# EAGLE design 3dring (EAGLE 7.1.0)
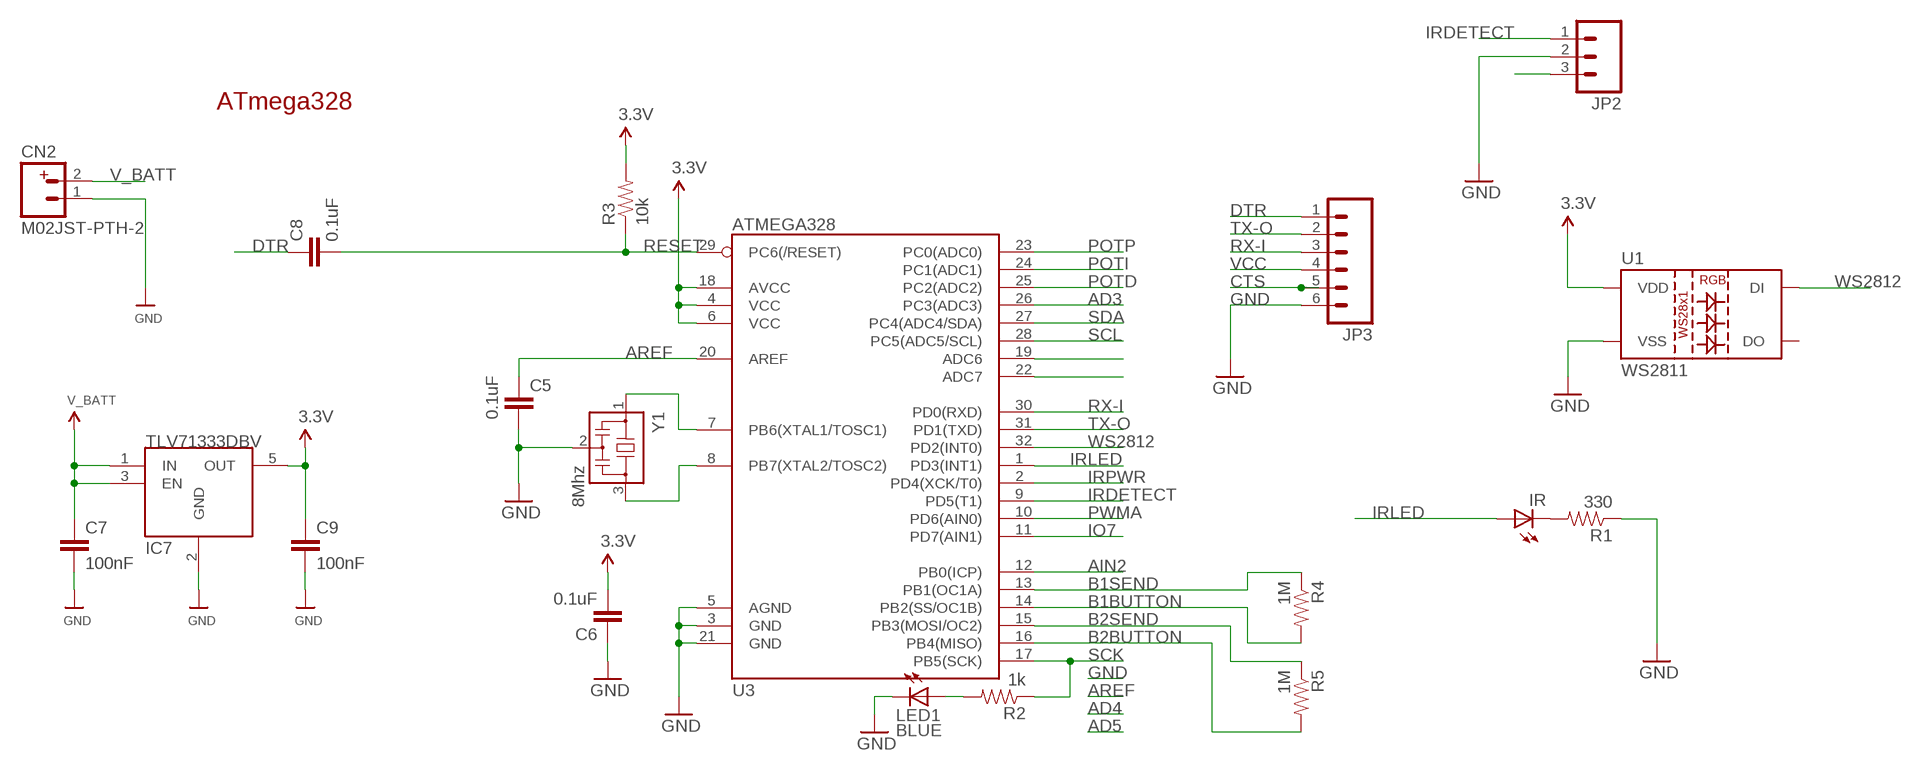
[diagram p0: schematic, sheet 1]

## Parts
C5  0.1uF  CAP0402-CAP  [0402-CAP]
C6  0.1uF  CAP0402-CAP  [0402-CAP]
C7  100nF  C-EUC0402  [C0402]
C8  0.1uF  CAP0402-CAP  [0402-CAP]
C9  100nF  C-EUC0402  [C0402]
CN2  M02JST-PTH-2  [JST-2-PTH]
IC7  TLV71333DBV  [SOT-23-5]
IR  LED5MM  [LED5MM]
JP2  M03PTH  [1X03]
JP3  M06SMD-1MM  [1X06-1MM]
LED1  BLUE  LED0603  [LED-0603]
R1  330  RESISTOR0402-RES  [0402-RES]
R2  1k  RESISTOR0402-RES  [0402-RES]
R3  10k  RESISTOR0402-RES  [0402-RES]
R4  1M  RESISTOR0402-RES  [0402-RES]
R5  1M  RESISTOR0402-RES  [0402-RES]
U1  WS2811  LED-TRICOLOR-5050-ICWS2811  [LED-TRICOLOR-5050-IC]
U3  ATMEGA328  ATMEGA168  [TQFP32-08]
Y1  8Mhz  CSTCR6M00G53Z  [CSTCR6M]

## Nets
AD3: U3.26(PC3(ADC3))
AIN2: U3.12(PB0(ICP))
AREF: C5.1 U3.20(AREF)
B1BUTTON: R4.2 U3.14(PB2(SS/OC1B))
B1SEND: R4.1 U3.13(PB1(OC1A))
B2BUTTON: R5.2 U3.16(PB4(MISO))
B2SEND: R5.1 U3.15(PB3(MOSI/OC2))
CTS: JP3.5
DTR: C8.1 JP3.1
GND: C5.2 C6.1 C7.2 C9.2 CN2.1 IC7.2(GND) JP2.2 JP3.6 LED1.C R1.1 U1.6(VSS) U3.3(GND) U3.5(AGND) U3.21(GND) Y1.2
IO7: U3.11(PD7(AIN1))
IRDETECT: JP2.1 U3.9(PD5(T1))
IRLED: IR.A U3.1(PD3(INT1))
IRPWR: JP2.3 U3.2(PD4(XCK/T0))
N$1: LED1.A R2.2
N$2: U3.19(ADC6)
N$3: IR.K(C) R1.2
N$4: U3.7(PB6(XTAL1/TOSC1)) Y1.1
N$5: U3.8(PB7(XTAL2/TOSC2)) Y1.3
N$6: U3.22(ADC7)
POTD: U3.25(PC2(ADC2))
POTI: U3.24(PC1(ADC1))
POTP: U3.23(PC0(ADC0))
PWMA: U3.10(PD6(AIN0))
RESET: C8.2 R3.1 U3.29(PC6(/RESET))
RX-I: JP3.3 U3.30(PD0(RXD))
SCK: R2.1 U3.17(PB5(SCK))
SCL: U3.28(PC5(ADC5/SCL))
SDA: U3.27(PC4(ADC4/SDA))
TX-O: JP3.2 U3.31(PD1(TXD))
V_BATT: C7.1 CN2.2 IC7.1(IN) IC7.3(EN)
VCC: C6.2 C9.1 IC7.5(OUT) JP3.4 R3.2 U1.3(VDD) U1.5(VDD) U3.4(VCC) U3.6(VCC) U3.18(AVCC) ; supply symbol labelled 3.3V
WS2812: U1.2(DI) U3.32(PD2(INT0))
Unconnected: U1.1(DO)

## Notes on the sheet
- ATmega328

## Library data of the parts
C5 C6 C8 = SparkFun:CAP: Capacitor Standard 0603 ceramic capacitor, and 0.1" leaded capacitor.
C7 C9 = rcl:C-EU: CAPACITOR, European symbol
CN2 = SparkFun-Connectors:M02: Standard 2-pin 0.1" header. Use with - straight break away headers ( PRT-00116) - right angle break away headers (PRT-00553) - swiss pins (PRT-00743) - machine pins (PRT-00117) - female headers (PRT-00115) Molex polarized connector foot print use with: PRT-08233 with associated crimp pins and housings. 2.54_SCREWTERM for use with PRT-10571. 3.5mm Screw Terminal footprints for PRT-08084 5mm Screw Terminal footprints for use with PRT-08433
IC7 = anoven:TLV713: Capacitor-Free, 150-mA, Low-Dropout Regulator with Foldback Current Limit for Portable Devices
IR = SparkFun-LED:LED: LEDs Standard schematic elements and footprints for 5mm, 3mm, 1206, and 0603 sized LEDs. 5mm - Spark Fun Electronics SKU : COM-00529 (and others)
JP2 = SparkFun:M03: Header 3 Standard 3-pin 0.1" header. Use with straight break away headers (SKU : PRT-00116), right angle break away headers (PRT-00553), swiss pins (PRT-00743), machine pins (PRT-00117), and female headers (PRT-00115). Molex polarized connector foot print use with SKU : PRT-08232 with associated crimp pins and housings.
JP3 = SparkFun-Connectors:M06: Header 6 Standard 6-pin 0.1" header. Use with straight break away headers (SKU : PRT-00116), right angle break away headers (PRT-00553), swiss pins (PRT-00743), machine pins (PRT-00117), and female headers (PRT-00115). Molex polarized connector foot print use with SKU : PRT-08094 with associated crimp pins and housings. NOTES ON THE VARIANTS LOCK and LOCK_LONGPADS... This footprint was designed to help hold the alignment of a through-hole component (i.e. 6-pin header) while soldering it into place. You may notice that each hole has been shifted either up or down by 0.005 of an inch from it's more standard position (which is a perfectly straight line). This slight alteration caused the pins (the squares in the middle) to touch the edges of the holes. Because they are alternating, it causes a "brace" to hold the component in place. 0.005 has proven to be the perfect amount of "off-center" position when using our standard breakaway headers. Although looks a little odd when you look at the bare footprint, once you have a header in there, the alteration is very hard to notice. Also,if you push a header all the way into place, it is covered up entirely on the bottom side. This idea of altering the position of holes to aid alignment will be further integrated into the Sparkfun Library for other footprints. It can help hold any component with 3 or more connection pins.
LED1 = SparkFun:LED: LEDs Standard schematic elements and footprints for 5mm, 3mm, 1206, and 0603 sized LEDs. 5mm - Spark Fun Electronics SKU : COM-00529 (and others)
R1-R5 = SparkFun:RESISTOR: Resistor Basic schematic elements and footprints for 0603, 1206, and PTH resistors.
U1 = SparkFun-LED:LED-TRICOLOR-5050-IC: WS2811 RGB LED w/driver 5x5mm SMD LED with built-in controller IC. DIO-11598; PROD_ID: DIO-11598
U3 = SparkFun:ATMEGA168
Y1 = murata-filter:CSTCR: Resonator Source: murata.co.jp; MPN: CSTCR6M00G53-R0; OC_FARNELL: 1170434; OC_NEWARK: 25M8759

## Net classes
1 vcc: width 0.254 mm

## Board
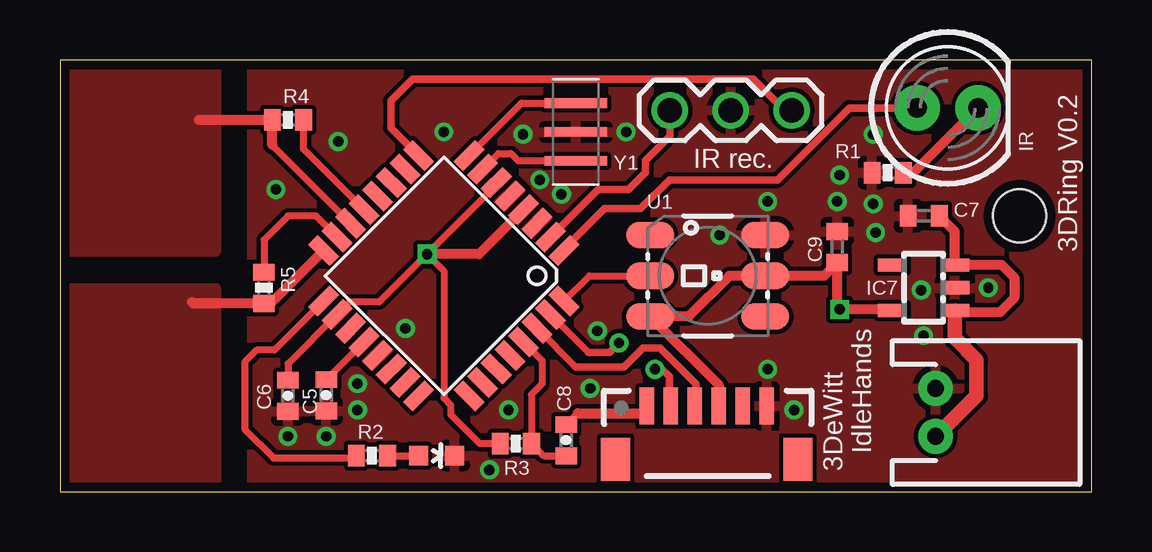
[diagram p1: board, top side]
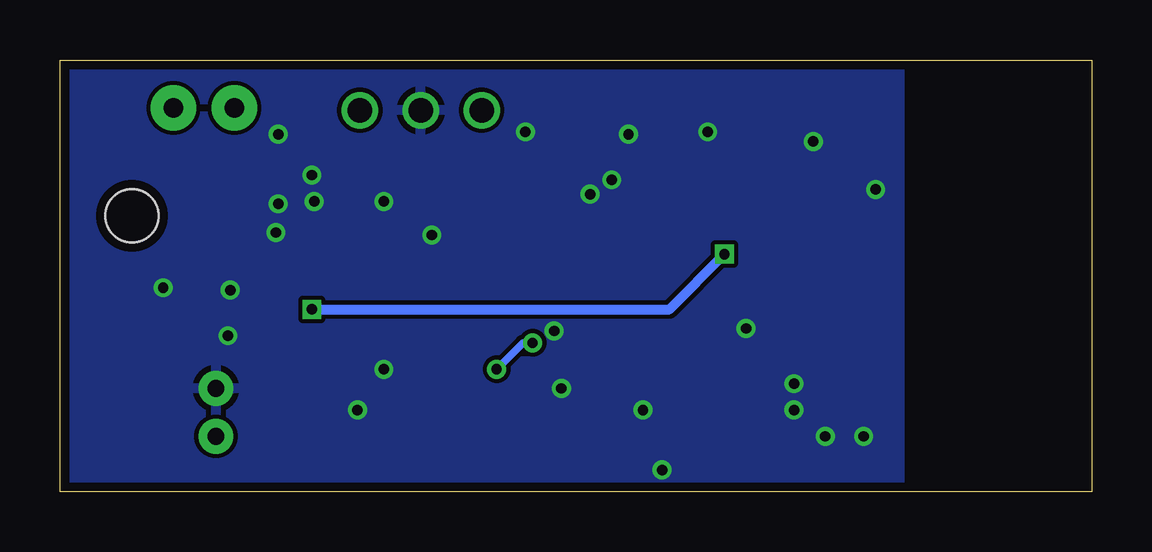
[diagram p2: board, bottom side, seen from below]

Size 43 x 18 mm. Coordinates in mm from the lower left corner, seen from the top.
Outline: 0,0 43,0 43,18 0,18 0,0
Copper layers (1*16): Top 0.0356mm / dielectric 1.5011mm / Bottom 0.0356mm
Design rules "LaenPCBOrder *": minimum track width 6mil, minimum drill 13mil, track to track 7mil, track to pad 7mil, pad to pad 7mil, via to via 7mil, smd to smd 7mil, copper to edge 15mil, drill to drill 6mil, minimum pad ring 7mil, minimum via ring 7mil, stop-mask expansion 3mil, vias tented up to drill 0mil, thermal gap 10mil
Holes 2.2 mm at 40,11.5

### Footprints (pad centres in the part's own frame; a part is rotated, then mirrored left to right if it is on the bottom)
0402-CAP = smd 0.7 x 0.9: 1 -0.65,0; 2 0.65,0
C0402 = smd 0.7 x 0.9: 1 -0.65,0; 2 0.65,0
JST-2-PTH = drill 0.7 pad 1.448: 1 -1,0; 2 1,0
SOT-23-5 = smd 0.55 x 1.2: 1 -0.95,-1.3; 2 0,-1.3; 3 0.95,-1.3; 4 0.95,1.3; 5 -0.95,1.3
LED5MM = drill 0.813 pad 1.88: A -1.27,0; K 1.27,0
1X03 = drill 1.016: 1 0,0; 2 2.54,0; 3 5.08,0
1X06-1MM = smd 0.6 x 1.55: 1 -2.54,1.27; 2 -1.54,1.27; 3 -0.54,1.27; 4 0.46,1.27; 5 1.46,1.27; 6 2.46,1.27 | smd 1.2 x 1.8: P$1 -3.84,-0.955; P$2 3.76,-0.955
LED-0603 = smd 0.8 x 0.8: A 0,-0.75; C 0,0.75
0402-RES = smd 0.7 x 0.9: 1 -0.65,0; 2 0.65,0
LED-TRICOLOR-5050-IC = smd 2 x 1.1: 1 -2.4,1.7; 2 -2.4,0; 3 -2.4,-1.7; 4 2.4,-1.7; 5 2.4,0; 6 2.4,1.7
TQFP32-08 = smd 1.27 x 0.559: 1 -4.293,2.8; 2 -4.293,2; 3 -4.293,1.2; 4 -4.293,0.4; 5 -4.293,-0.4; 6 -4.293,-1.2; 7 -4.293,-2; 8 -4.293,-2.8; 17 4.293,-2.8; 18 4.293,-2; 19 4.293,-1.2; 20 4.293,-0.4; 21 4.293,0.4; 22 4.293,1.2; 23 4.293,2; 24 4.293,2.8 | smd 0.559 x 1.27: 9 -2.8,-4.293; 10 -2,-4.293; 11 -1.2,-4.293; 12 -0.4,-4.293; 13 0.4,-4.293; 14 1.2,-4.293; 15 2,-4.293; 16 2.8,-4.293; 25 2.8,4.293; 26 2,4.293; 27 1.2,4.293; 28 0.4,4.293; 29 -0.4,4.293; 30 -1.2,4.293; 31 -2,4.293; 32 -2.8,4.293
CSTCR6M = smd 0.4 x 2.6: 1 -1.2,0; 2 0,0; 3 1.2,0

### Placement (x,y rotation side)
C5  11.1,4.02 270 top
C6  9.5,4 90 top
C7  36,11.5 180 top
C8  21.1,2.14 270 top
C9  32.4,10.2 90 top
CN2  36.5,3.3 270 top
IC7  36,8.5 90 top
IR  37,16 0 top
JP2  30.5,15.9 180 top
JP3  27,2.3 0 top
LED1  15.7,1.5 270 top
R1  34.5,13.3 0 top
R2  13,1.5 0 top
R3  19,2 180 top
R4  9.5,15.5 180 top
R5  8.5,8.5 270 top
U1  27,9 0 top
U3  16,9 225 top
Y1  21.5,15 90 top

### Tracks (layer width: path | path; a pad name or v marks a point on that pad's centre or on a via)
AREF
  Top 0.3: U3.20 C5.1
B1BUTTON
  Top 0.3: 8.85,14.45 U3.14
  Top 0.406: 5.8,15.5 R4.2 8.85,14.45
  pour Top: 0,18 6.5,18 6.5,10 0,10
B1SEND
  Top 0.3: U3.13 10.15,14.28 R4.1
B2BUTTON
  Top 0.406: 5.5,7.9 5.55,7.85 R5.2 8.78,7.85 U3.16
  pour Top: 0,0 0,8.5 6.5,8.5 6.5,0
B2SEND
  Top 0.3: U3.15 10.67,11.5 9.5,11.5 8.5,10.5 R5.1
DTR
  Top 0.3: C8.1 21.58,3.27
  Top 0.406: 21.58,3.27 24.36,3.27 JP3.1
GND  (via drill 0.43)
  other vias: 11.6,14.6 9,12.6 16,15 19.3,14.9 23.6,15 20.9,12.4 20,13 18.7,3.4 12.4,3.4 11.1,2.3 9.5,2.3 17.9,0.9 29.5,5.1 30.6,3.4 29.5,12.1 27.5,10.7 22.4,6.7 22.1,4.3 33.9,12 32.4,12.1 32.5,13.2 33.9,14.9 34,10.8 36,6.5 35.9,8.4 14.4,6.8 12.4,4.5 38.7,8.5
  pour Bottom: 8,0 8,18 43,18 43,0
  pour Top: 8,0 8,18 43,18 43,0
IRDETECT
  Top 0.305: JP2.1 30.2,15.9 28.9,17.2 14.7,17.2 13.8,16.3 13.8,15.16 U3.9
IRLED
  Top 0.305: U3.1 21.02,10.12 22.7,11.8 24.2,11.8 25.4,13 29.9,13 32.9,16 IR.A
IRPWR
  Top 0.305: JP2.3 25.42,14.82 24.4,13.8 24.4,13.3 23.7,12.6 22.43,12.6 U3.2
N$1
  Top 0.3: R2.2 LED1.A
N$3
  Top 0.406: R1.2 35.57,13.3 IR.K
N$4
  Top 0.3: U3.7 18.27,14.1 18.8,14.1 19.1,13.8 Y1.1
N$5
  Top 0.3: U3.8 19.24,16.2 Y1.3
RESET
  Top 0.3: U3.29 20.1,5.47 20.1,4.5 19.65,4.05 R3.1 20.16,1.49 C8.2
RX-I
  Top 0.3: U3.30 21.5,5.2
  Top 0.305: 21.5,5.2 23.5,5.2 24.3,6 25,6 26.5,4.5 26.5,3.61 JP3.3
SCK
  Top 0.3: U3.17 8.94,5.9 8.2,5.9 7.7,5.4 7.7,2.6 8.9,1.4 12.25,1.4 R2.1
TX-O  (via drill 0.43)
  Top 0.3: U3.31 22.03,5.8
  Top 0.305: 22.03,5.8 22.9,5.8 v23.3,6.2 | v24.8,5.1 25.1,5.1 25.4,4.8 25.4,3.63 JP3.2
  Bottom 0.305: v23.3,6.2 23.7,6.2 v24.8,5.1
V_BATT
  Top 0.406: C7.1 37.3,10.85 IC7.3 39.25,9.45 39.8,8.9 39.8,8.1 39.2,7.5 37.35,7.5 IC7.1
  Top 0.61: CN2.2 38.2,4 38.2,5.5 37.3,6.4 IC7.1
VCC  (via drill 0.43)
  Top 0.3: C6.2 9.5,5.33 U3.18 12.07,7.9 13.3,7.9 v15.3,9.9 | R3.2 17.5,2 16.3,3.2 16.3,3.6 16,3.9 16,9.2 v15.3,9.9 | U3.6 18.19,12.79 v15.3,9.9
  Top 0.406: IC7.5 34.4,7.55 34.35,7.6 v32.5,7.6 32.4,7.7 C9.1 31.85,9 U1.5 27.9,9 26.2,7.3 U1.3 27.46,4.44 JP3.4 | U3.4 17.47,9.9 v15.3,9.9
  Bottom 0.406: v32.5,7.6 17.6,7.6 v15.3,9.9
WS2812
  Top 0.3: U3.32 22.07,9 U1.2

### Text on the board
tNames: IR rec. | 3DRing V0.2 | IdleHands | 3DeWitt